# EAGLE schematic 555-Oscillator (EAGLE 7.2.0)
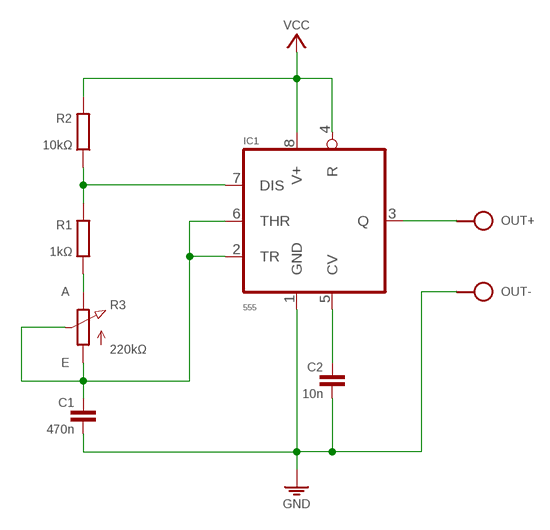
[diagram p0: schematic, sheet 1]

## Parts
C1  470n  C050-024X044/V  [C050-024X044/V]
C2  10n  C050-020X036/V  [C050-020X036/V]
IC1  555  555_ALT  [DIL08]
OUT  SPAD+--+  [SPAD-+]
R1  1kΩ  R0207/10  [0207/10]
R2  10kΩ  R0207/10  [0207/10]
R3  220kΩ  POT-V  [POT-V]
S1  VCC_GNDPWR-R  [PWR-R]

## Nets
CV: R1.2 R3.E
DIS: IC1.7(DIS) R1.1 R2.2
GND: C1.2 C2.2 IC1.1(GND) OUT.1 S1.1
N$6: C2.1 IC1.5(CV)
OUT: IC1.3(Q) OUT.2
TR: C1.1 IC1.2(TR) IC1.6(THR) R3.A R3.S
VCC: IC1.4(R) IC1.8(V+) R2.1 S1.2

## Library data of the parts
C1 C2 = c:C: CAPACITOR, European symbol
IC1 = ic:*555_ALT
OUT = pad:SPAD+-
R1 R2 = r:R: RESISTOR, European symbol
R3 = r:POT
S1 = pad:VCC_GND